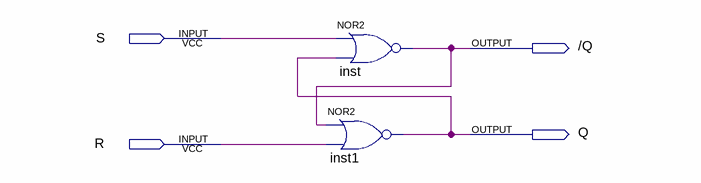
[diagram p0: schematic sheet]
// Quartus schematic sr_ff.bdf as structural Verilog: 2 symbols, 4 pins
module sr_ff (
  input  S,
  input  R,
  output \/Q ,
  output Q
);

  nor inst (\/Q , S, Q);
  nor inst1 (Q, \/Q , R);
endmodule
